# EasyEDA schematic 1-Schematic_TFG-DALI.json
TITLE: Sheet_1; REV: 1.0; Date: 2024-07-22; Sheet: 1/1; Drawn By: jfjm0003; Company: Universidad de Jaén
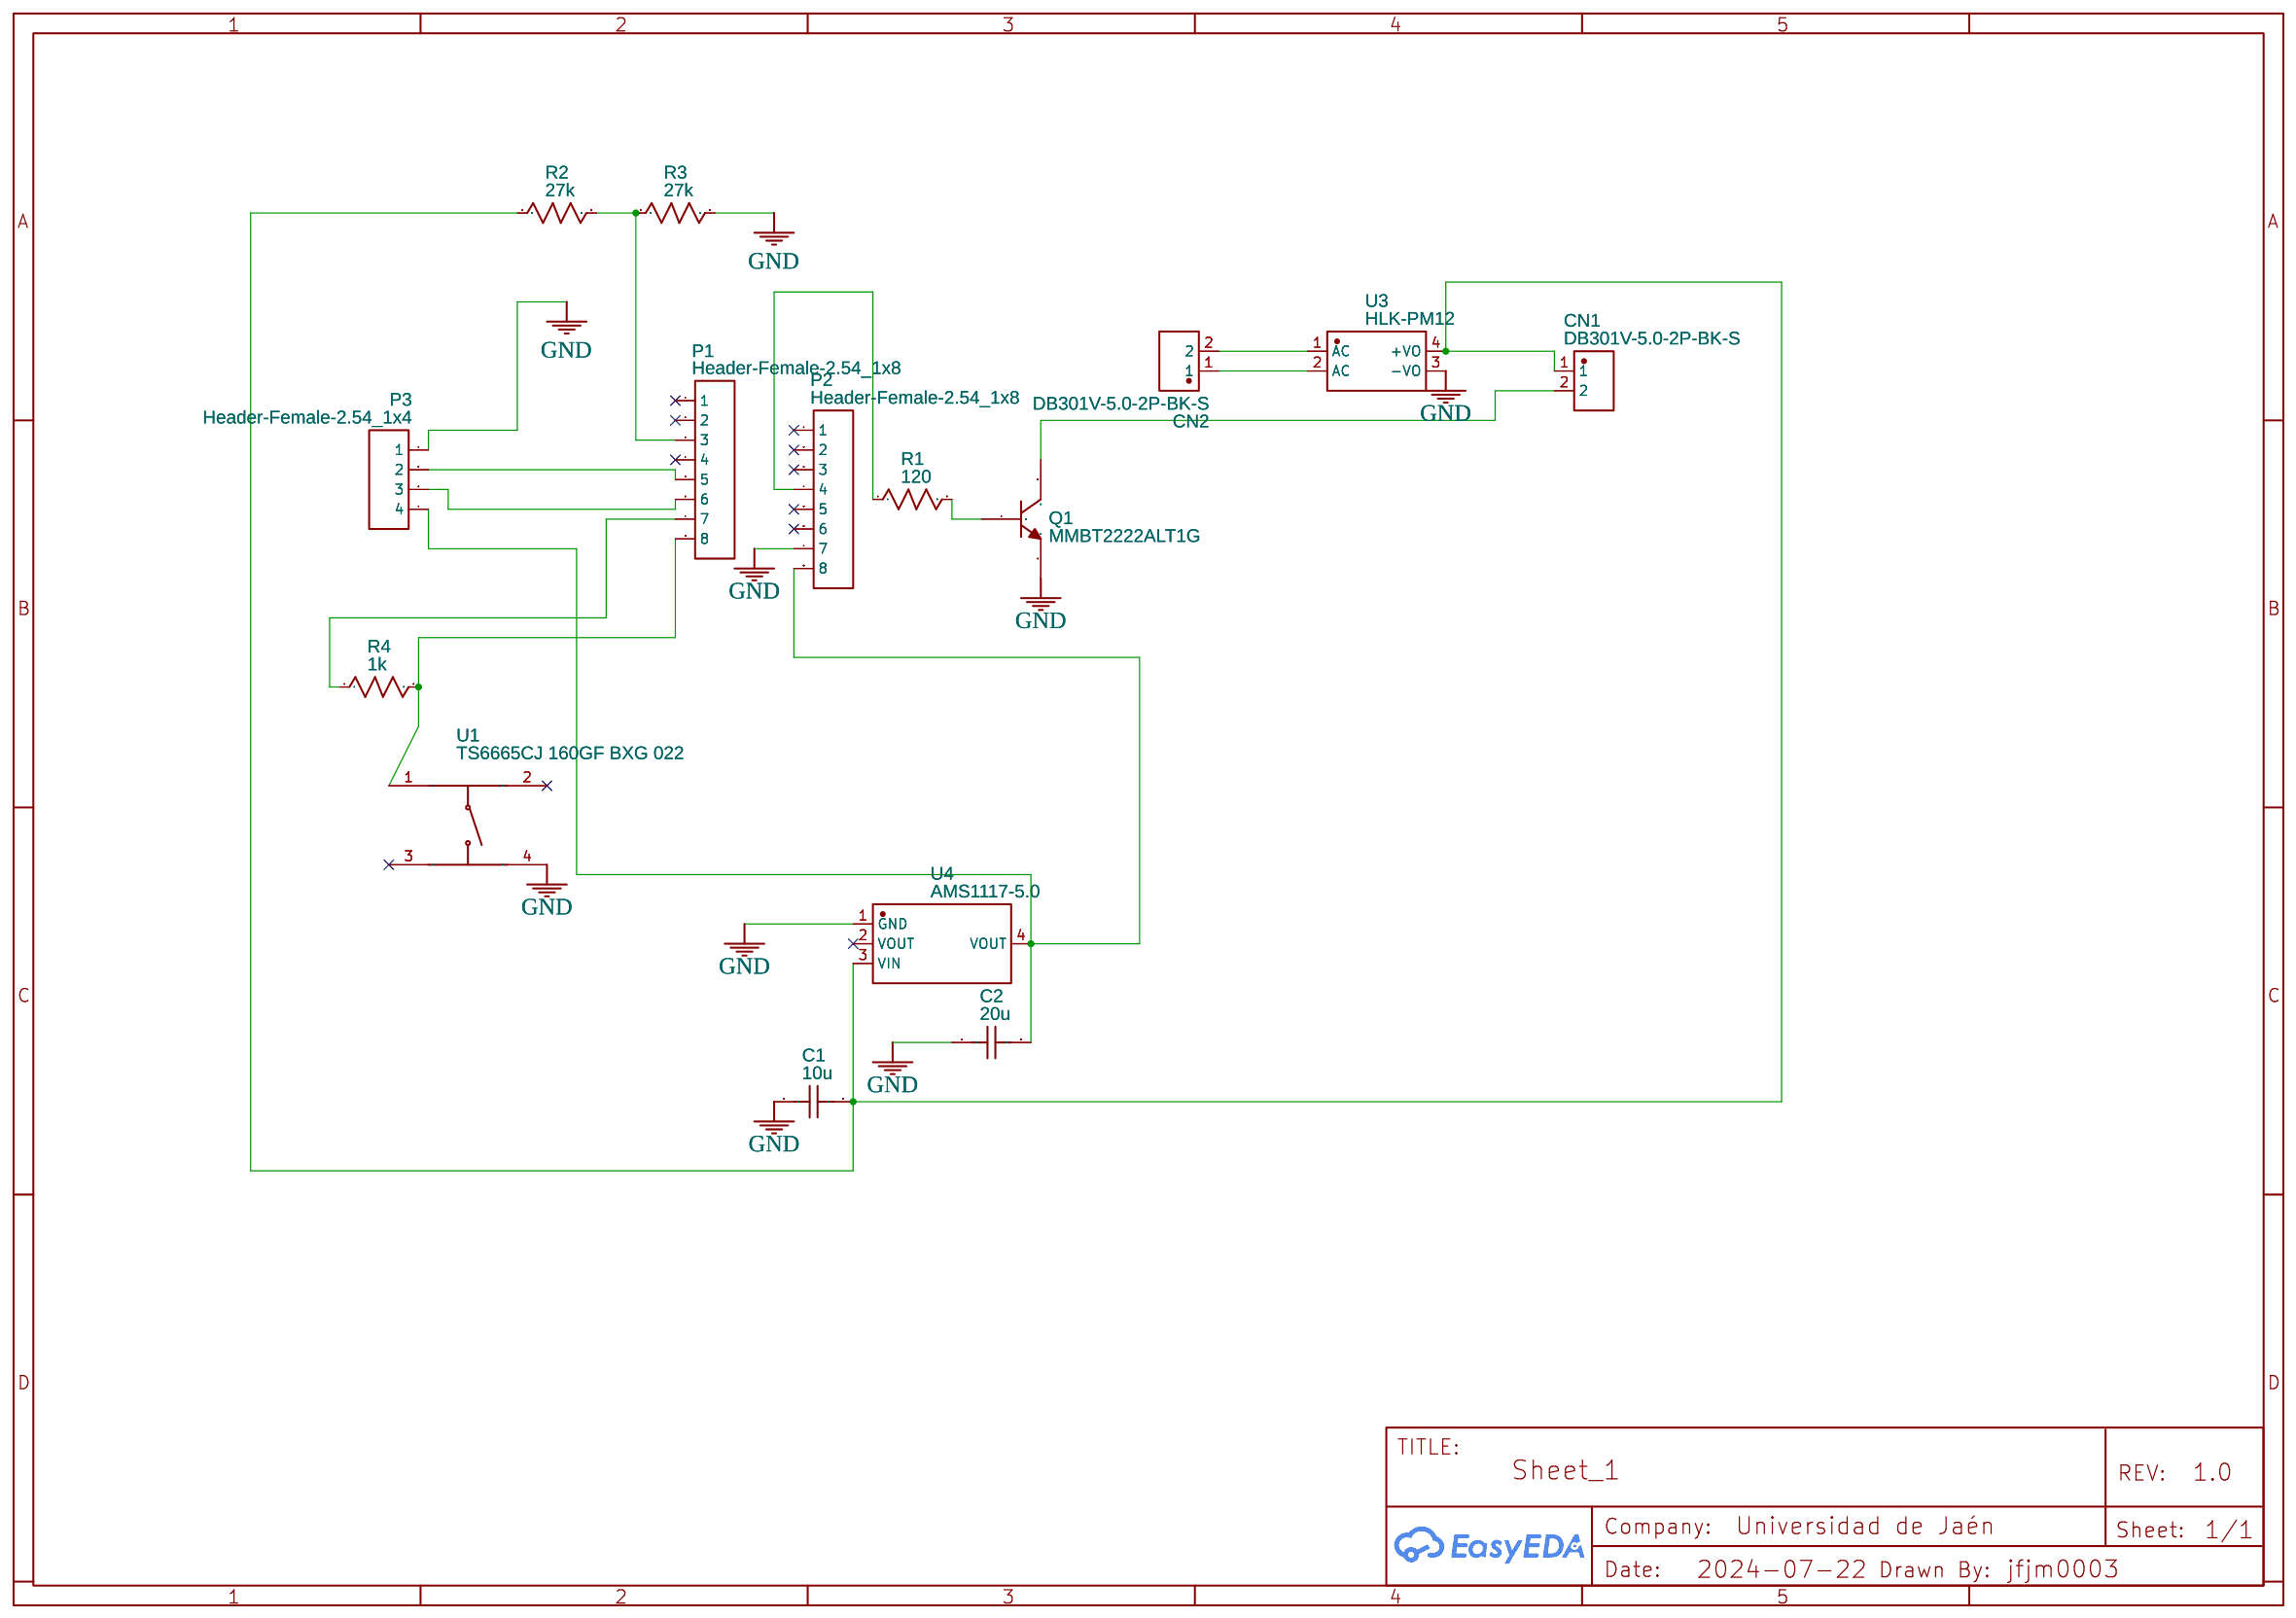
[diagram p0: schematic sheet]

## Parts
C1  10u  [C1206]
C2  20u  [C1206]
CN1  DB301V-5.0-2P-BK-S  [CONN-TH_2P-P5.00_DB301V-5.0-2P-GN-S]
CN2  DB301V-5.0-2P-BK-S  [CONN-TH_2P-P5.00_DB301V-5.0-2P-GN-S]
P1  Header-Female-2.54_1x8  [HDR-TH_8P-P2.54-V-F-1]
P2  Header-Female-2.54_1x8  [HDR-TH_8P-P2.54-V-F-1]
P3  Header-Female-2.54_1x4  [HDR-4X1/2.54]
Q1  MMBT2222ALT1G  [SOT-23-3_L2.9-W1.3-P1.90-LS2.4-BR]
R1  120  [R0603]
R2  27k  [R0603]
R3  27k  [R0603]
R4  1k  [R0603]
U1  TS6665CJ 160GF BXG 022  [SW-TH_4P-L6.0-W6.0-P4.50-LS6.5]
U3  HLK-PM12  [PWRM-TH_HLK-PM12]
U4  AMS1117-5.0  [SOT-223_L6.5-W3.5-P2.30-LS7.0-BR]

## Library data of the parts
C1 = C_0603_US: Supplier Part: C13585; Supplier: LCSC; Contributor: LCEDA_Lib; Manufacturer Part: CL31A106KBHNNNE; Manufacturer: SAMSUNG(三星); Package Display: No
C2 = C_0603_US: Supplier Part: C6565591; Supplier: LCSC; Contributor: LCEDA_Lib; Manufacturer Part: GRMJN7R61C206ME05D; Manufacturer: muRata(村田); Package Display: No
CN1 CN2 = DB301V-5.0-2P-BK-S: Supplier: LCSC; Supplier Part: C5143709; Manufacturer: DORABO(地博电气); JLCPCB Part Class: Extended Part; Contributor: lcsc
P1 P2 = Header-Female-2.54_1x8: Supplier: LCSC; Manufacturer: BOOMELE(博穆精密); Manufacturer Part: 2.54-1*8P母环保; Supplier Part: C27438; JLCPCB Part Class: Extended Part
P3 = Header-Female-2.54_1x4: Supplier: LCSC; Manufacturer: ReliaPro; Supplier Part: C124413
Q1 = MMBT2222ALT1G: Supplier: LCSC; Manufacturer: onsemi(安森美); Supplier Part: C82460; JLCPCB Part Class: Extended Part
R1-R4 = R_0603_US: Contributor: LCEDA_Lib
U1 = TS6665CJ 160GF BXG 022: Contributor: lcsc; Supplier: LCSC; Supplier Part: C5369135; Manufacturer: SHOU HAN(首韩); Manufacturer Part: TS6665CJ 160gf BXG 022; JLCPCB Part Class: Extended Part
U3 = HLK-PM12: Contributor: LCSC; Supplier: LCSC; Supplier Part: C209905; Manufacturer: HI-LINK(海凌科); JLCPCB Part Class: Extended Part
U4 = AMS1117-5.0: sourceId: HltLFyQwq; Supplier: LCSC; Manufacturer: AMS; Supplier Part: C6187; JLCPCB Part Class: Basic Part

## Nets
GND: C1.1 C2.1 P2.7 P3.1 Q1.2(E) R3.2 U1.4(D) U3.3(-VO) U4.1(GND)
Net-(C1-2): C1.2 CN1.1 R2.1 U3.4(+VO) U4.3(VIN)
Net-(C2-2): C2.2 P2.8 P3.4 U4.4(VOUT)
Net-(CN1-2): CN1.2 Q1.3(C)
Net-(CN2-1): CN2.1 U3.2(AC)
Net-(CN2-2): CN2.2 U3.1(AC)
Net-(P1-3): P1.3 R2.2 R3.1
Net-(P1-5): P1.5 P3.2
Net-(P1-6): P1.6 P3.3
Net-(P1-7): P1.7 R4.1
Net-(P1-8): P1.8 R4.2 U1.1(A)
Net-(P2-4): P2.4 R1.1
Net-(Q1-1): Q1.1(B) R1.2

Not connected (* = marked no-connect by the designer): P1 1* 2* 4*; P2 1* 2* 3* 5* 6*; U1 2(B)* 3(C)*; U4 2(VOUT)*
